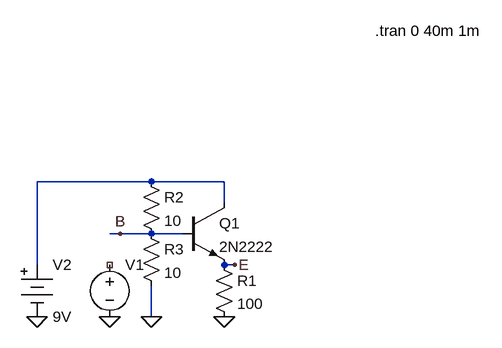
[diagram p0: schematic CurrentAmplifier.asc]
CurrentAmplifier.asc, the LTspice schematic file:
Version 4
SHEET 1 880 680
WIRE 256 240 80 240
WIRE 368 240 256 240
WIRE 368 272 368 240
WIRE 208 320 192 320
WIRE 256 320 208 320
WIRE 304 320 256 320
WIRE 80 368 80 240
WIRE 384 368 368 368
WIRE 256 448 256 400
FLAG 368 448 0
FLAG 192 448 0
FLAG 80 448 0
FLAG 208 320 B
FLAG 384 368 E
FLAG 256 448 0
SYMBOL npn 304 272 R0
SYMATTR InstName Q1
SYMATTR Value 2N2222
SYMBOL voltage 192 352 R0
WINDOW 3 24 96 Invisible 2
SYMATTR InstName V1
SYMATTR Value SINE(4 4 100 0 0 0 4)
SYMBOL res 352 352 R0
SYMATTR InstName R1
SYMATTR Value 100
SYMBOL Misc/battery 80 352 R0
SYMATTR InstName V2
SYMATTR Value 9V
SYMBOL res 240 224 R0
SYMATTR InstName R2
SYMATTR Value 10
SYMBOL res 240 304 R0
SYMATTR InstName R3
SYMATTR Value 10
TEXT 600 8 Left 2 !.tran 0 40m 1m

The netlist it stands for:
* CurrentAmplifier.asc
Q1 N001 B E 0 2N2222
V1 NC_01 0 SINE(4 4 100 0 0 0 4)
R1 E 0 100
V2 N001 0 9V
R2 N001 B 10
R3 B 0 10
.model NPN NPN
.model PNP PNP
.lib standard.bjt
.tran 0 40m 1m
.backanno
.end